# Altium project DrillingL052.PrjPcb
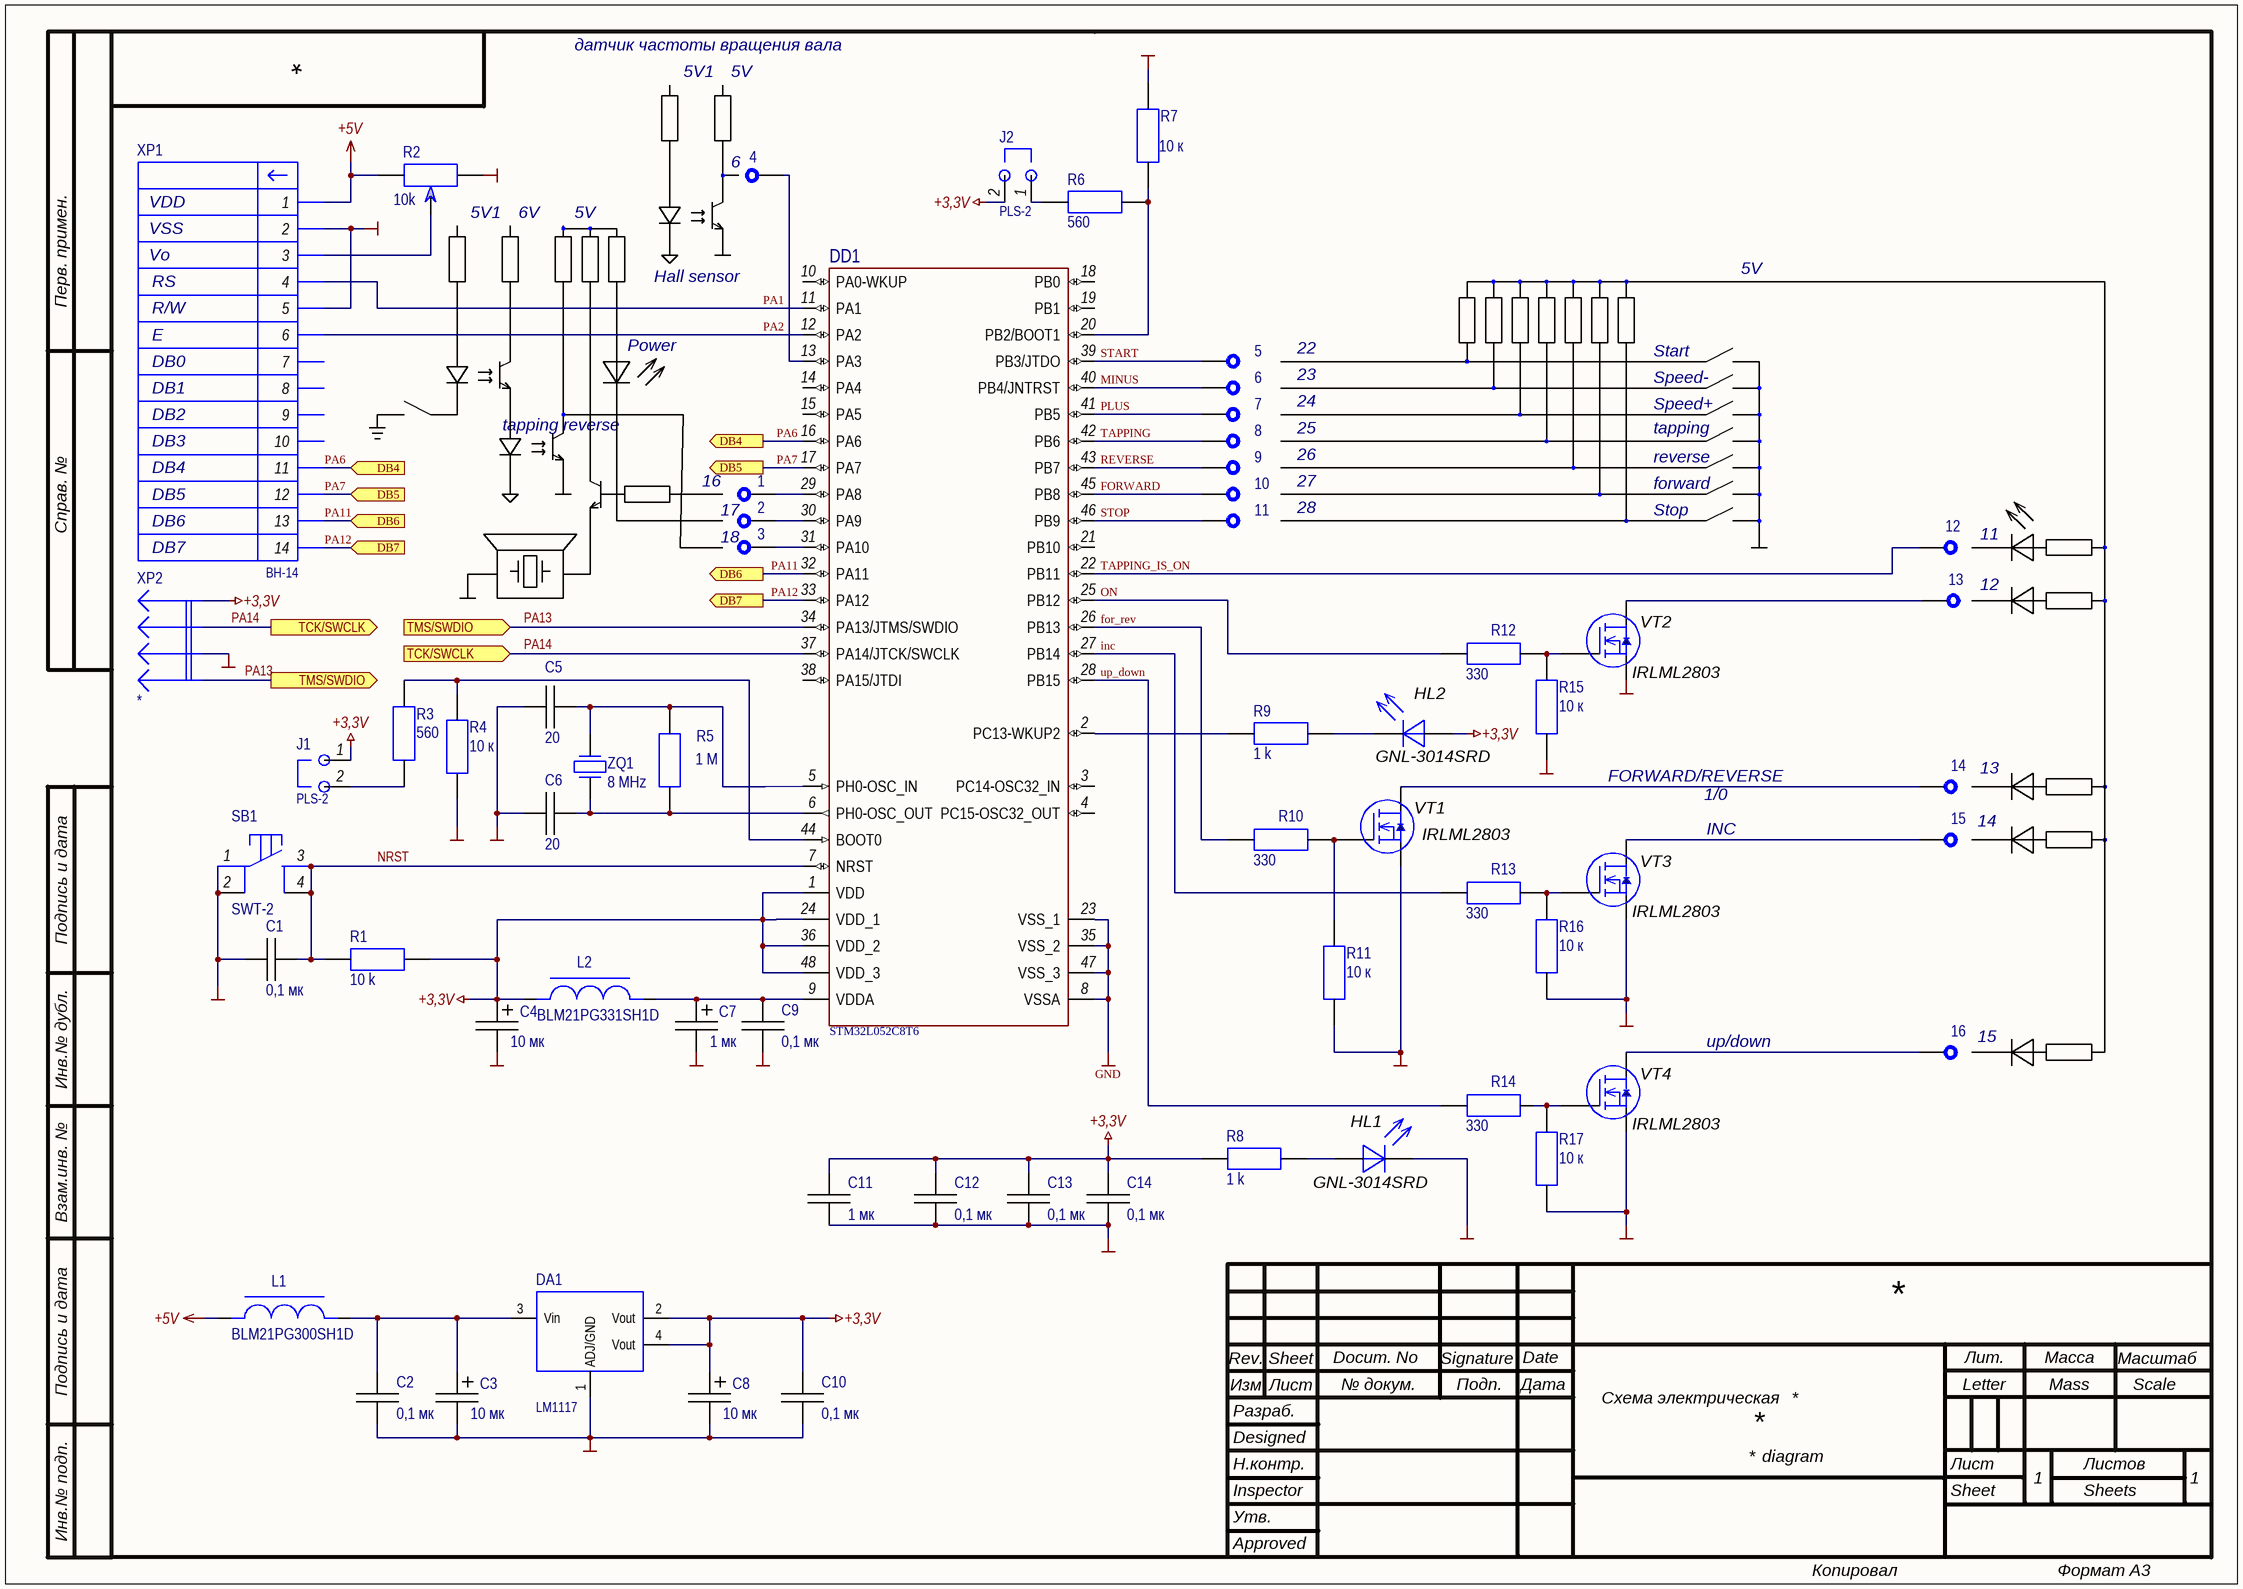
[diagram p0: DrillingL152.SchDoc]
1 sheet, 63 parts. Net scope: flat (ports and power ports of the same name join across sheets).
Board file: Stanok_driver.PcbDoc

## Sheet DrillingL152.SchDoc
size 420 x 297 mm; Date: 05.02.15; Organization: TCNIRT; SheetNumber: 1; SheetTotal: 1; PageSetup: Record=PageOptions|CenterHorizontal=False|CenterVertical=False|PrintScale=1.00|XCorrection=0.00|YCorrection=0.00|PrintKind=1|BorderSize=5000000|LeftOffset=0|BottomOffset=0|Orientation=1|PaperLength=1000|PaperWidth=1000|Scale=100|PaperSource=7|PrintQuality=300|MediaType=1|DitherType=10|PaperKind=A4|PrintScaleMode=0; CodeScheme: Э3; DocumentName: Панель

### Parts
1  PIN  [Hole]  (value not drawn)
2  PIN  [Hole]  (value not drawn)
3  PIN  [Hole]  (value not drawn)
4  PIN  [Hole]  (value not drawn)
5  PIN  [Hole]  (value not drawn)
6  PIN  [Hole]  (value not drawn)
7  PIN  [Hole]  (value not drawn)
8  PIN  [Hole]  (value not drawn)
9  PIN  [Hole]  (value not drawn)
10  PIN  [Hole]  (value not drawn)
11  PIN  [Hole]  (value not drawn)
12  PIN  [Hole]  (value not drawn)
13  PIN  [Hole]  (value not drawn)
14  PIN  [Hole]  (value not drawn)
15  PIN  [Hole]  (value not drawn)
16  PIN  [Hole]  (value not drawn)
C1  0,1 мк  [C0805]
C2  0,1 мк  [CAPC_1206]
C3  10 мк  [3216]
C4  10 мк  [3216]
C5  20  [CAPC_1206]
C6  20  [CAPC_1206]
C7  1 мк  [3216]
C8  10 мк  [3216]
C9  0,1 мк  [C0805]
C10  0,1 мк  [CAPC_1206]
C11  1 мк  [CAPC_1206]
C12  0,1 мк  [C0805]
C13  0,1 мк  [C0805]
C14  0,1 мк  [C0805]
DA1  LM1117  [SOT223]
DD1  STM32L052C8T6  [LQFP48_L]
HL1  GNL-3014SRD  [1206]
HL2  GNL-3014SRD  [1206]
J1  PLS-2  [PLS-2]
J2  PLS-2  [PLS-2]
L1  BLM21PG300SH1D  [C0805]
L2  BLM21PG331SH1D  [C0805]
R1  10 k  [RC0805-2]
R2  10k  [3296W]
R3  560  [RC0805-2]
R4  10 к  [RC0805-2]
R5  1 М  [SMD_1206]
R6  560  [RC0805-2]
R7  10 к  [RC0805-2]
R8  1 k  [RC0805-2]
R9  1 k  [RC0805-2]
R10  330  [RC0805-2]
R11  10 к  [RC0805-2]
R12  330  [RC0805-2]
R13  330  [RC0805-2]
R14  330  [RC0805-2]
R15  10 к  [RC0805-2]
R16  10 к  [RC0805-2]
R17  10 к  [RC0805-2]
SB1  SWT-2  [SWT2]
VT1  IRLML2803  [SOT-23_N]
VT2  IRLML2803  [SOT-23_N]
VT3  IRLML2803  [SOT-23_N]
VT4  IRLML2803  [SOT-23_N]
XP1  BH-14  [PLD-14]
XP2  *  [PLS-4]
ZQ1  8 MHz  [HC-49U]

### Ports
DB4 (in), DB4 (out), DB5 (in), DB5 (out), DB6 (in), DB6 (out), DB7 (in), DB7 (out), TCK/SWCLK (in), TCK/SWCLK (out), TMS/SWDIO (in), TMS/SWDIO (out)

### Nets
+3,3V: C4.1(+) C8.1(+) C10.1 C11.1 C12.1 C13.1 C14.1 DA1.2(Vout) DA1.4(Vout) DD1.1(VDD) DD1.24(VDD_1) DD1.36(VDD_2) DD1.48(VDD_3) HL2.1(A) J1.1 J2.2 L2.1 R1.2 R8.1 XP2.1
+5V: L1.1 R2.3 XP1.1
GND: C1.1 C2.2 C3.2(-) C4.2(-) C5.1 C6.1 C7.2(-) C8.2(-) C9.2 C10.2 C11.2 C12.2 C13.2 C14.2 DA1.1(ADJ/GND) DD1.8(VSSA) DD1.23(VSS_1) DD1.35(VSS_2) DD1.47(VSS_3) HL1.2(K) R2.1 R4.2 R7.2 R11.1 R15.1 R16.1 R17.1 SB1.1 SB1.2 VT1.2(S) VT2.2(S) VT3.2(S) VT4.2(S) XP1.2 XP1.5 XP2.3
for_rev: DD1.26(PB13) R10.2
FORWARD: 10.1 DD1.45(PB8)
inc: DD1.27(PB14) R13.2
MINUS: 6.1 DD1.40(PB4/JNTRST)
NRST: C1.2 DD1.7(NRST) R1.1 SB1.3 SB1.4
ON: DD1.25(PB12) R12.2
PA1: DD1.11(PA1) XP1.4
PA2: DD1.12(PA2) XP1.6
PA6: DD1.16(PA6) XP1.11 ; port DB4
PA7: DD1.17(PA7) XP1.12 ; port DB5
PA11: DD1.32(PA11) XP1.13 ; port DB6
PA12: DD1.33(PA12) XP1.14 ; port DB7
PA13: DD1.34(PA13/JTMS/SWDIO) XP2.4 ; port TMS/SWDIO
PA14: DD1.37(PA14/JTCK/SWCLK) XP2.2 ; port TCK/SWCLK
PLUS: 7.1 DD1.41(PB5)
REVERSE: 9.1 DD1.43(PB7)
START: 5.1 DD1.39(PB3/JTDO)
STOP: 11.1 DD1.46(PB9)
TAPPING: 8.1 DD1.42(PB6)
TAPPING_IS_ON: 12.1 DD1.22(PB11)
up_down: DD1.28(PB15) R14.2
Net1_1: 1.1 DD1.29(PA8)
Net2_1: 2.1 DD1.30(PA9)
Net3_1: 3.1 DD1.31(PA10)
Net4_1: 4.1 DD1.13(PA3)
Net13_1: 13.1 VT2.3(D)
Net14_1: 14.1 VT1.3(D)
Net15_1: 15.1 VT3.3(D)
Net16_1: 16.1 VT4.3(D)
NetC2_1: C2.1 C3.1(+) DA1.3(Vin) L1.2
NetC5_2: C5.2 DD1.5(PH0-OSC_IN) R5.1 ZQ1.2
NetC6_2: C6.2 DD1.6(PH0-OSC_OUT) R5.2 ZQ1.1
NetC7_1: C7.1(+) C9.1 DD1.9(VDDA) L2.2
NetDD1_2: DD1.2(PC13-WKUP2) R9.1
NetDD1_20: DD1.20(PB2/BOOT1) R6.2 R7.1
NetDD1_44: DD1.44(BOOT0) R3.2 R4.1
NetHL1_1: HL1.1(A) R8.2
NetHL2_2: HL2.2(K) R9.2
NetJ1_2: J1.2 R3.1
NetJ2_1: J2.1 R6.1
NetR2_2: R2.2 XP1.3
NetR10_1: R10.1 R11.2 VT1.1(G)
NetR12_1: R12.1 R15.2 VT2.1(G)
NetR13_1: R13.1 R16.2 VT3.1(G)
NetR14_1: R14.1 R17.2 VT4.1(G)

Not connected (* = marked no-connect by the designer): DD1 3(PC14-OSC32_IN) 4(PC15-OSC32_OUT) 10(PA0-WKUP) 14(PA4) 15(PA5) 18(PB0) 19(PB1) 21(PB10) 38(PA15/JTDI); XP1 7 8 9 10

### Notes on the sheet
- датчик частоты вращения вала
- 5V1
- 5V
- (near 4) 6
- VDD
- VSS
- Vo
- (near R2) 5V1
- (near R2) 6V
- RS
- R/W
- Hall sensor
- E
- DB0
- DB1
- Power
- 22
- 23
- Start
- Speed-
- DB2
- DB3
- tapping reverse
- 24
- 25
- 26
- Speed+
- reverse
- tapping
- DB4
- DB5
- DB6
- 16
- 17
- 27
- 28
- Stop
- forward
- (near XP2) DB7
- 18
- 12
- (near 12) 11
- FORWARD/REVERSE
- 1/0
- (near 14) 13
- INC
- 14
- up/down
- (near 16) 15
- Перв. примен.
- Справ. №
- Подпись и дата
- Инв.№ дубл.
- Взам.инв. №
- Разраб.
- Изм
- Rev.
- Лист
- Sheet
- Docum. No
- № докум.
- Signature
- Подп.
- Date
- Дата
- Схема электрическая
- Лит.
- Letter
- Масса
- Mass
- Scale
- Масштаб
- Designed
- Н.контр.
- diagram
- Листов
- Инв.№ подп.
- Утв.
- Approved
- Inspector
- Sheets
- Копировал
- Формат А3

### Library data of the parts
1-16 = PIN: PIN, hole
C1 C2 C5 C6 C9-C14 = C: Capasitor; MarkPCB: *; Name: *
  C1: ValueSCH: 0,1 мк
  C2 C9 C10 C12-C14: ValueSCH: 0,1 мк; Part Number: C; Component Kind: Standard; Component Type: Standard; Designator: C; Footprint: K73-17; Pin Count: 2
  C5 C6: ValueSCH: 20
  C11: ValueSCH: 1 мк; Part Number: C; Component Kind: Standard; Component Type: Standard; Designator: C; Footprint: K73-17; Pin Count: 2
C3 C4 C7 C8 = CapPol: Capasitor_polar; Part Number: CapPol; Component Kind: Standard; Component Type: Standard; Designator: CapPol; Footprint: CapPolar; Pin Count: 2
  C3 C4 C8: ValueSCH: 10 мк
  C7: ValueSCH: 1 мк
DA1 = LM1117: Positive voltage regulators; Manufacturer: National Semiconductor; Корпус: SOT-223; ComponentLink1Description: Параметры; ComponentLink2Description: Сайт производителя; ComponentLink2URL: *; ManufacturerPartNumber: LM1117; Power\Voltage: *; Rem: *; TKE: *; Tolerance: *; TU/GOST: *; Value: *; Примечание: *; Mark: *
DD1 = STM32F103C8T6: STM32 ARM-based 32-bit MCU with 32 Kbytes Flash, 48-pin LQFP, Industrial Temperature; Published: 30-May-2008; DatasheetVersion: rev6, Mar-2008; PackageVersion: Mar-2008; PackageReference: LQFP48; Publisher: Altium Limited; PackageDescription: 48-Pin Low-Profile Quad Flat Pack, 7 x 7 mm Body, 0.5 mm Pitch (LQFP48); ComponentLink1Description: Manufacturer Link; ComponentLink1URL: www.st.com/stm32; ComponentLink2Description: Datasheet; ComponentLink2URL: http://www.st.com/stonline/products/literature/ds/13587.pdf
HL1 HL2 = GNL-3014RED: ValueBOM: Диод GNL-3014SRD; Type: VD; Part Number: GNL-3014RED; Value: GNL-3014SRD; ComponentLink1URL: E:\BaseComponent_TCNIRT\PDF\GNL-3014.pdf; ComponentLink1Description: Datasheet; Date: 01.10.2019
J1 J2 = J2: PLS-02; Manufacturer: Ningbo; Jamper: S; ComponentLink1Description: Параметры; ComponentLink2Description: Сайт производителя; ComponentLink2URL: *; ManufacturerPartNumber: PLS-2; Power\Voltage: *; Rem: *; TKE: *; Tolerance: *; TU/GOST: *; Value: *; Примечание: *
L1 L2 = B: Ferrite bead; datasheet: *
  L1: Value: BLM21PG300SH1D
  L2: Value: BLM21PG331SH1D
R1 R3-R17 = R_Gost: Resistor,2 Pin; ValueBOM: *; MarkPCB: *
  R1: ValueSCH: 10 k
  R3 R6: ValueSCH: 560
  R4 R7 R11 R15-R17: ValueSCH: 10 к
  R5: ValueSCH: 1 М
  R8 R9: ValueSCH: 1 k
  R10 R12-R14: ValueSCH: 330
R2 = Res_trimmer: 3296W; Value: 10k; ComponentLink1URL: *; ManufacturerPartNumber: *; Supplier Part Number 1: *; ComponentLink1Description: Параметры; Manufacturer: *; Power\Voltage: *; Tolerance: *; ComponentLink2URL: *; TU/GOST: *; Корпус: *; Примечание: *; ComponentLink2Description: Сайт протзводителя; ValueSCH: *; Name: 3296W
SB1 = SWT-2: SWT-2, key; Value: SWT-2
VT1-VT4 = IRLML2803: Manufacturer: Intarnational Rectifier; ValueBOM: Транзистор IRLML2803; Type: VT; Part Number: IRLML2803; Value: IRLML2803; ComponentLink1URL: E:\BaseComponent_TCNIRT\PDF\irlml2803pbf.pdf; ComponentLink1Description: Datasheet; Date: 01.10.2019
XP1 = BH-14: Manufacturer: Ningbo; ComponentLink1Description: Параметры; ComponentLink2Description: Сайт производителя; ComponentLink2URL: *; ManufacturerPartNumber: BH-14; Power\Voltage: *; Rem: *; TKE: *; Tolerance: *; TU/GOST: *; Value: *; Примечание: *
XP2 = XP4: Value: *
ZQ1 = OSC: Value: 8 MHz; ManufacturerPartNumber: *; ComponentLink1URL: D:\datasheet\Кварцы\00688.pdf; Manufacturer: *